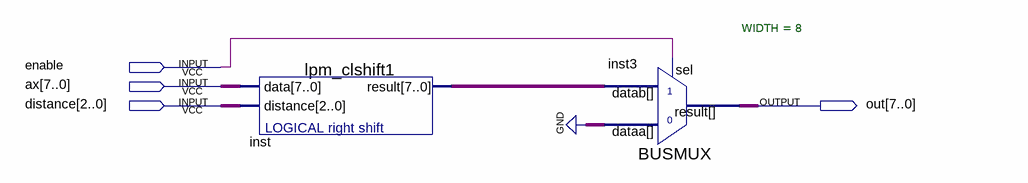
[diagram p0: schematic sheet]
// Quartus schematic ALU_SRL.bdf as structural Verilog: 2 symbols, 4 pins
module ALU_SRL (
  input  enable,
  input  [7:0] ax,
  input  [2:0] distance,
  output [7:0] out
);

  wire [7:0] inst_result;

  lpm_clshift1 inst (.data(ax), .distance(distance), .result(inst_result));
  BUSMUX #(.WIDTH(8)) inst3 (.datab(inst_result), .sel(enable), .dataa({8{1'b0}}), .result(out));
endmodule
